# EAGLE design ddc_kvm (EAGLE 6.6.0)
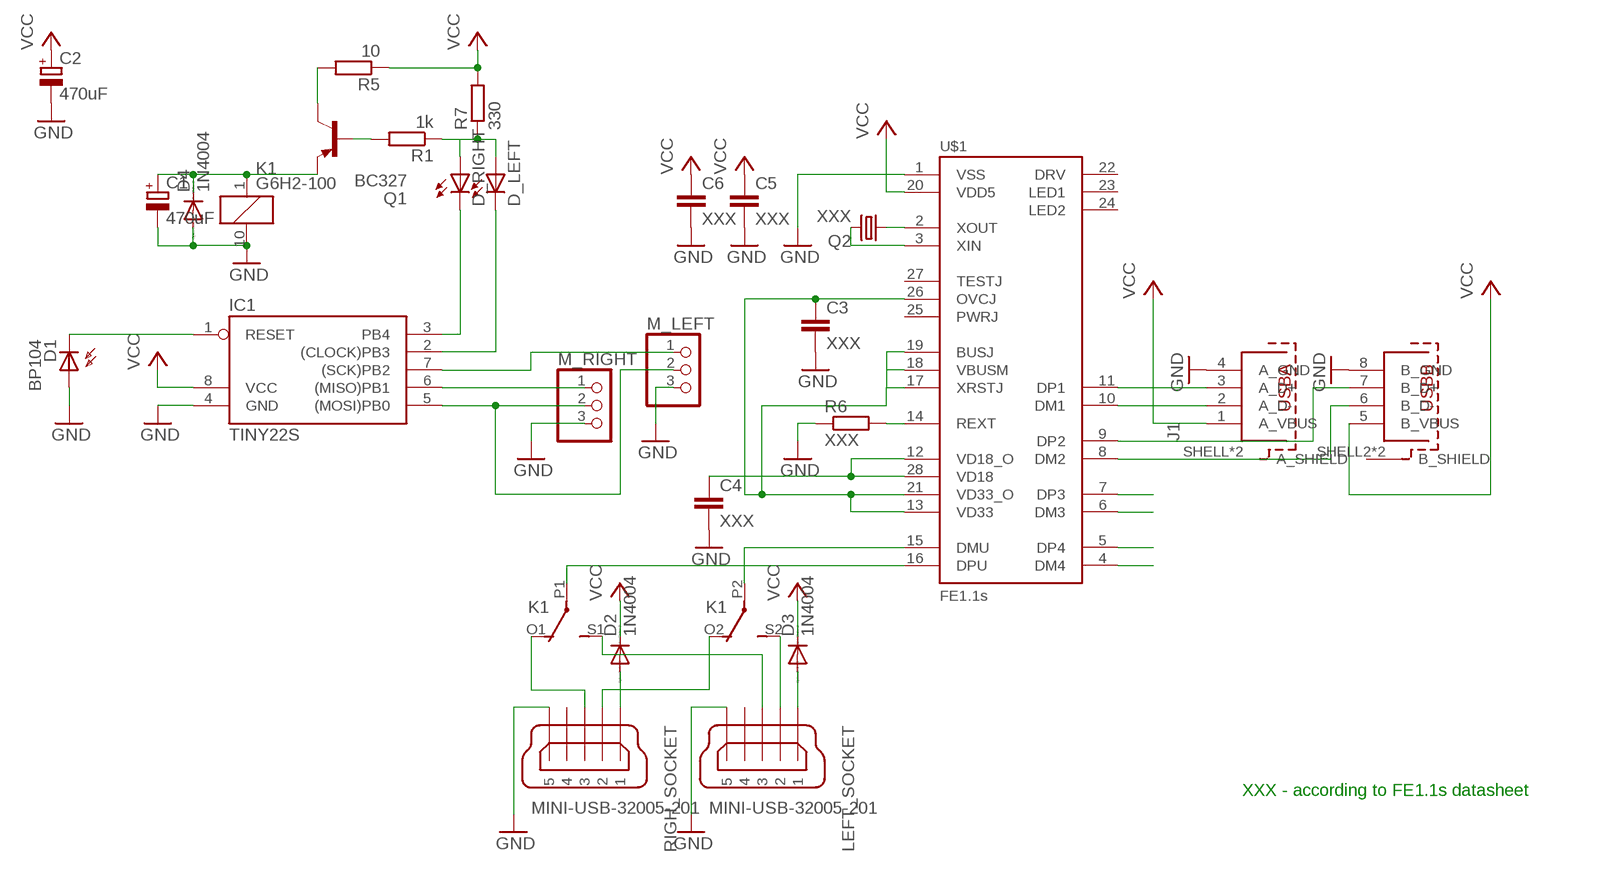
[diagram p0: schematic, sheet 1]

## Parts
C1  470uF  CPOL-EUE3.5-8  [E3,5-8]
C2  470uF  CPOL-EUE3.5-10  [E3,5-10]
C3  XXX  C-EUC0603  [C0603]
C4  XXX  C-EUC0603  [C0603]
C5  XXX  C-EUC0603  [C0603]
C6  XXX  C-EUC0603  [C0603]
D1  BP104  [BP104]
D2  1N4004  [DO41-10]
D3  1N4004  [DO41-10]
D4  1N4004  [DO41-10]
D_LEFT  LED5MM  [LED5MM]
D_RIGHT  LED5MM  [LED5MM]
IC1  TINY22S  [SOIC8]
J1  61400826021  [61400826021]
K1  G6H2-100  [G6H2-100]
LEFT_SOCKET  MINI-USB-32005-201  [32005-201]
M_LEFT  PINHD-1X3  [1X03]
M_RIGHT  PINHD-1X3  [1X03]
Q1  BC327  [TO92]
Q2  XXX  CRYSTALHC49S  [HC49/S]
R1  1k  R-EU_R0603  [R0603]
R5  10  R-EU_0204/2V  [0204V]
R6  XXX  R-EU_R0603  [R0603]
R7  330  R-EU_R0603  [R0603]
RIGH_SOCKET  MINI-USB-32005-201  [32005-201]
U$1  FE1.1S  [FE1.1S_SSOP-28]

## Nets
GND: C1.- C2.- C3.2 C4.2 C5.2 C6.2 D1.A D4.A IC1.4(GND) J1.4(A_GND) J1.8(B_GND) K1.10 LEFT_SOCKET.5 M_LEFT.3 M_RIGHT.3 R6.1 RIGH_SOCKET.5 U$1.1(VSS)
N$1: J1.3(A_D+) U$1.11(DP1)
N$2: J1.2(A_D-) U$1.10(DM1)
N$3: J1.7(B_D+) U$1.9(DP2)
N$4: J1.6(B_D-) U$1.8(DM2)
N$5: Q2.1 U$1.2(XOUT)
N$6: Q2.2 U$1.3(XIN)
N$7: R6.2 U$1.14(REXT)
N$8: K1.S2(3:S) LEFT_SOCKET.2
N$9: K1.O1(2:O) RIGH_SOCKET.3
N$10: K1.P2(3:P) U$1.15(DMU)
N$11: K1.O2(3:O) RIGH_SOCKET.2
N$12: K1.S1(2:S) LEFT_SOCKET.3
N$13: K1.P1(2:P) U$1.16(DPU)
N$14: D3.A LEFT_SOCKET.1
N$15: D2.A RIGH_SOCKET.1
N$16: IC1.5((MOSI)PB0) M_LEFT.2 M_RIGHT.2
N$17: D1.K(C) IC1.1(RESET)
N$18: IC1.6((MISO)PB1) M_RIGHT.1
N$19: IC1.7((SCK)PB2) M_LEFT.1
N$20: Q1.3(C) R5.2
N$21: D_RIGHT.K(C) IC1.3(PB4)
N$22: D_LEFT.K(C) IC1.2((CLOCK)PB3)
N$23: D_LEFT.A D_RIGHT.A R1.1 R7.1
N$24: Q1.2(B) R1.2
N$25: C1.+ D4.C K1.1 Q1.1(E)
N$26: C3.1 U$1.13(VD33) U$1.17(XRSTJ) U$1.18(VBUSM) U$1.19(BUSJ) U$1.21(VD33_O) U$1.26(OVCJ)
N$27: C4.1 U$1.12(VD18_O) U$1.28(VD18)
N$28: U$1.7(DP3)
N$29: U$1.6(DM3)
N$30: U$1.5(DP4)
N$31: U$1.4(DM4)
VCC: C2.+ C5.1 C6.1 D2.C D3.C IC1.8(VCC) J1.1(A_VBUS) J1.5(B_VBUS) R5.1 R7.2 U$1.20(VDD5)
Unconnected: J1.SHELL1(A_SHIELD) J1.SHELL2(B_SHIELD) J1.SHELL3(B_SHIELD) J1.SHELL(A_SHIELD) LEFT_SOCKET.4 RIGH_SOCKET.4 U$1.22(DRV) U$1.23(LED1) U$1.24(LED2) U$1.25(PWRJ) U$1.27(TESTJ)

## Notes on the sheet
- XXX - according to FE1.1s datasheet

## Library data of the parts
C1 C2 = resistor:CPOL-EU: POLARIZED CAPACITOR, European symbol
C3-C6 = resistor:C-EU: CAPACITOR, European symbol
D1 = opto-trans-siemens:BP104: PHOTO DIODE; MF: VISHAY/TELEFUNKEN; MPN: BP104; OC_FARNELL: 1779636; OC_NEWARK: 14M4504
D2-D4 = diode:1N4004: DIODE general purpose rectifier, 1 A
D_LEFT D_RIGHT = led:LED: LED OSRAM: - CHIPLED LG R971, LG N971, LY N971, LG Q971, LY Q971, LO R971, LY R971 LH N974, LH R974 LS Q976, LO Q976, LY Q976 LO Q996 - Hyper CHIPLED LW Q18S LB Q993, LB Q99A, LB R99A - SideLED LS A670, LO A670, LY A670, LG A670, LP A670 LB A673, LV A673, LT A673, LW A673 LH A674 LY A675 LS A676, LA A676, LO A676, LY A676, LW A676 LS A679, LY A679, LG A679 - Hyper Micro SIDELED® LS Y876, LA Y876, LO Y876, LY Y876 LT Y87S - SmartLED LW L88C, LW L88S LB L89C, LB L89S, LG L890 LS L89K, LO L89K, LY L89K LS L896, LA L896, LO L896, LY L896 - TOPLED LS T670, LO T670, LY T670, LG T670, LP T670 LSG T670, LSP T670, LSY T670, LOP T670, LYG T670 LG T671, LOG T671, LSG T671 LB T673, LV T673, LT T673, LW T673 LH T674 LS T676, LA T676, LO T676, LY T676, LB T676, LH T676, LSB T676, LW T676 LB T67C, LV T67C, LT T67C, LS T67K, LO T67K, LY T67K, LW E67C LS E67B, LA E67B, LO E67B, LY E67B, LB E67C, LV E67C, LT E67C LW T67C LS T679, LY T679, LG T679 LS T770, LO T770, LY T770, LG T770, LP T770 LB T773, LV T773, LT T773, LW T773 LH T774 LS E675, LA E675, LY E675, LS T675 LS T776, LA T776, LO T776, LY T776, LB T776 LHGB T686 LT T68C, LB T68C - Hyper Mini TOPLED® LB M676 - Mini TOPLED Santana® LG M470 LS M47K, LO M47K, LY M47K Source: http://www.osram.convergy.de LUXEON: - LUMILED® LXK2-PW12-R00, LXK2-PW12-S00, LXK2-PW14-U00, LXK2-PW14-V00 LXK2-PM12-R00, LXK2-PM12-S00, LXK2-PM14-U00 LXK2-PE12-Q00, LXK2-PE12-R00, LXK2-PE12-S00, LXK2-PE14-T00, LXK2-PE14-U00 LXK2-PB12-K00, LXK2-PB12-L00, LXK2-PB12-M00, LXK2-PB14-N00, LXK2-PB14-P00, LXK2-PB14-Q00 LXK2-PR12-L00, LXK2-PR12-M00, LXK2-PR14-Q00, LXK2-PR14-R00 LXK2-PD12-Q00, LXK2-PD12-R00, LXK2-PD12-S00 LXK2-PH12-R00, LXK2-PH12-S00 LXK2-PL12-P00, LXK2-PL12-Q00, LXK2-PL12-R00 Source: www.luxeon.com KINGBRIGHT: KA-3528ASYC Source: www.kingbright.com
IC1 = atmel:TINY22: MICROCONTROLLER 1K ROM 128 bytes RAM 128 bytes EEPROM; OC_FARNELL: unknown; OC_NEWARK: unknown
J1 = InputOutputIO (rev18a):61400826021: WR-COM Horizontal Dual Stacked USB Type A=>Code : Con_I-O_COM_USB-2.0_A_61400826021 <http://katalog.we-online.de/media/images/eican/Con_I-O_COM_USB-2.0_A_61400826021_pf2.jpg> Details see: http://katalog.we-online.de/en/em/614_008_260_21 Created 2014-07-09, Karrer Zheng 2014 (C) Würth Elektronik
K1 = relay:G6H2-100: RELAY 2 x switch, 0.5 A/125 V AC, 1 A/30 V DC, Omron; OC_FARNELL: unknown; OC_NEWARK: unknown
LEFT_SOCKET RIGH_SOCKET = con-cypressindustries:MINI-USB-: MINI USB-B Conector Source: www.cypressindustries.com; OC_FARNELL: unknown; OC_NEWARK: unknown
M_LEFT M_RIGHT = pinhead:PINHD-1X3: PIN HEADER
Q1 = transistor-pnp:BC327: PNP Transistor
Q2 = crystal:CRYSTAL: CRYSTAL; OC_FARNELL: 1667008; OC_NEWARK: unknown
R1 R5-R7 = resistor:R-EU_: RESISTOR, European symbol
U$1 = Ai_IC:FE1.1S

## Board
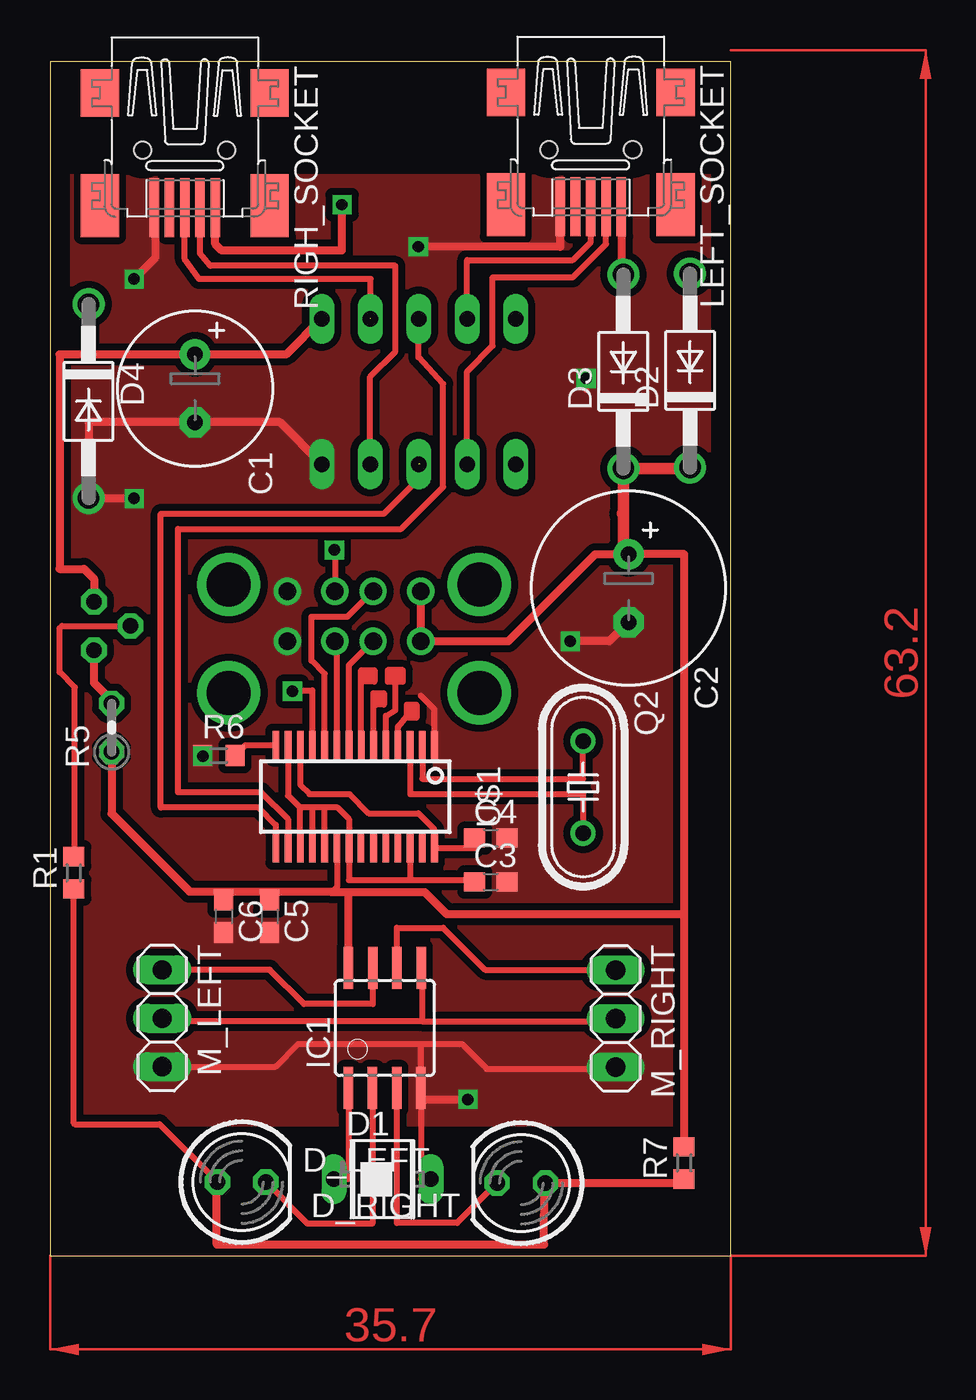
[diagram p1: board, top side]
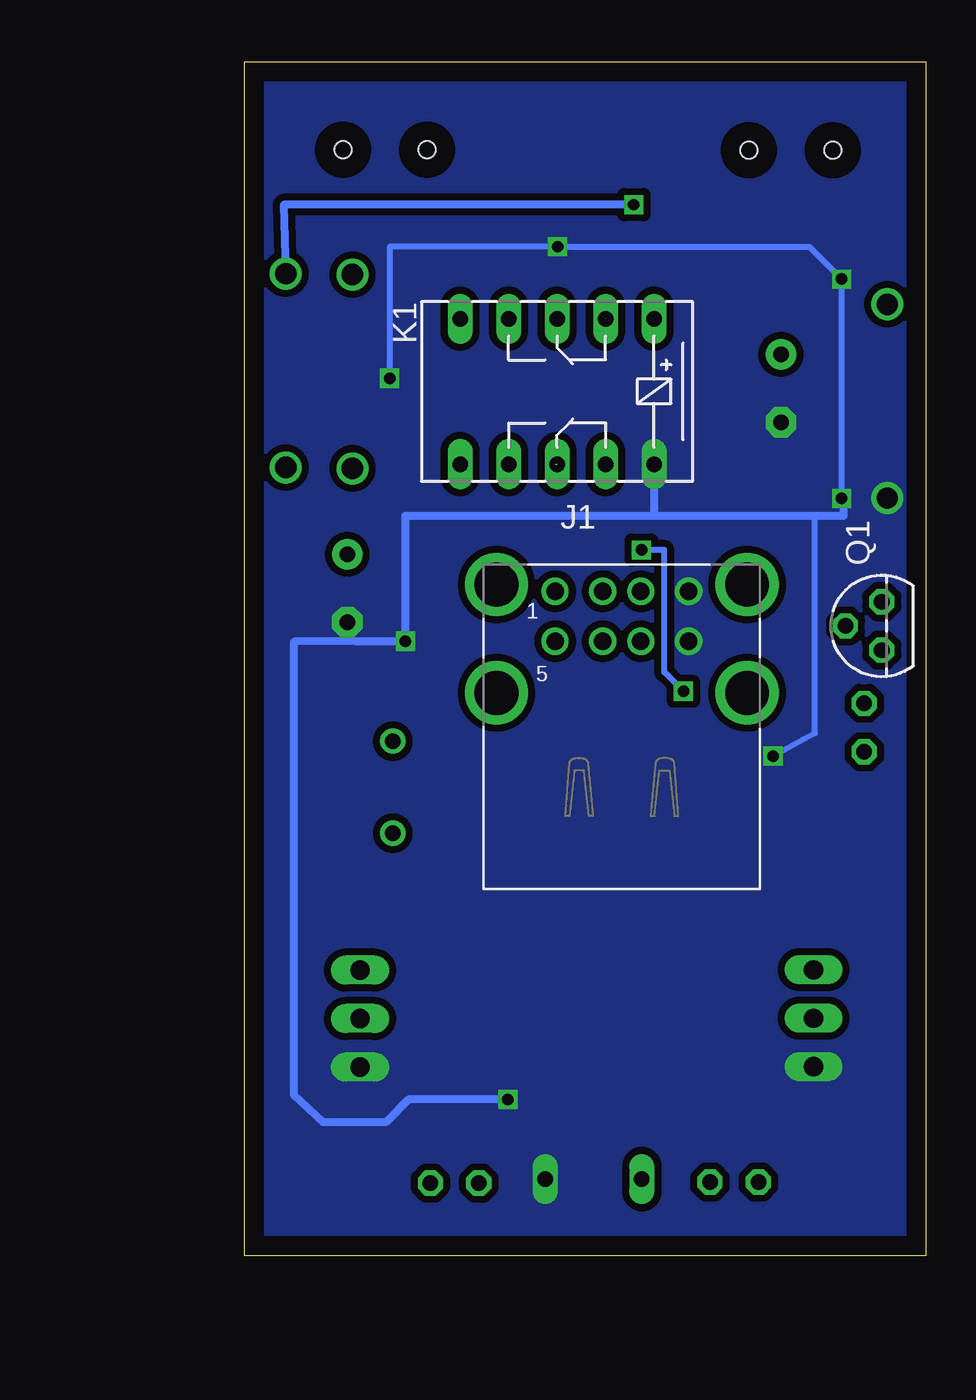
[diagram p2: board, bottom side, seen from below]

Size 35.7 x 62.6 mm. Coordinates in mm from the lower left corner, seen from the top.
Outline: 0,0 35.7,0 35.7,62.6 0,62.6 0,0
Copper layers (1*16): Top 0.035mm / dielectric 1.5mm / Bottom 0.035mm
Design rules "default": minimum track width 10mil, minimum drill 24mil, track to track 8mil, track to pad 8mil, pad to pad 8mil, via to via 8mil, smd to smd 8mil, copper to edge 40mil, drill to drill 8mil, minimum pad ring 10mil, minimum via ring 8mil, stop-mask expansion 4mil, vias tented up to drill 0mil, thermal gap 10mil

### Footprints (pad centres in the part's own frame; a part is rotated, then mirrored left to right if it is on the bottom)
E3,5-8 = drill 0.813 pad 1.6: + -1.778,0 | drill 0.813 pad 1.6 octagon: - 1.778,0
E3,5-10 = drill 0.813 pad 1.6: + -1.778,0 | drill 0.813 pad 1.6 octagon: - 1.778,0
C0603 = smd 1.1 x 1: 1 -0.85,0; 2 0.85,0
BP104 = drill 0.813 long: A 0,2.54; K 0,-2.54
DO41-10 = drill 1.118: A 5.08,0; C -5.08,0
LED5MM = drill 0.813 octagon: A -1.27,0; K 1.27,0
SOIC8 = smd 0.5 x 2.2: 1 -1.905,-3.154; 2 -0.645,-3.154; 3 0.625,-3.154; 4 1.895,-3.154; 5 1.905,3.154; 6 0.635,3.154; 7 -0.635,3.154; 8 -1.905,3.154
61400826021 = drill 0.92: 1 -3.5,5.33; 2 -1,5.33; 3 1,5.33; 4 3.5,5.33; 5 -3.5,2.71; 6 -1,2.71; 7 1,2.71; 8 3.5,2.71 | drill 2.3: SHELL -6.57,5.68; SHELL1 6.57,5.68; SHELL2 6.57,0; SHELL3 -6.57,0
G6H2-100 = drill 0.813 long: 1 -5.08,-3.81; 5 5.08,-3.81; 6 5.08,3.81; 10 -5.08,3.81; O1 -2.54,-3.81; O2 -2.54,3.81; P1 0,-3.81; P2 0,3.81; S1 2.54,-3.81; S2 2.54,3.81
32005-201 = smd 3.1 x 0.5: 1 3,1.6; 2 3,0.8; 3 3,0; 4 3,-0.8; 5 3,-1.6 | smd 2.5 x 2: M1 -3,-4.45; M2 -3,4.45 | smd 3.3 x 2: M3 2.9,4.45; M4 2.9,-4.45 | hole 0.9: 0,2.2; 0,-2.2
1X03 = drill 1.016 long: 1 -2.54,0; 2 0,0; 3 2.54,0
TO92 = drill 0.813 octagon: 1 1.27,0; 2 0,1.905; 3 -1.27,0
HC49/S = drill 0.813: 1 -2.413,0; 2 2.413,0
R0603 = smd 1 x 1.1: 1 -0.85,0; 2 0.85,0
0204V = drill 0.813 octagon: 1 -1.27,0; 2 1.27,0
FE1.1S_SSOP-28 = smd 0.35 x 1.5: 1 -4.16,-2.7; 2 -3.52,-2.7; 3 -2.88,-2.7; 4 -2.24,-2.7; 5 -1.6,-2.7; 6 -0.96,-2.7; 7 -0.32,-2.7; 8 0.32,-2.7; 9 0.96,-2.7; 10 1.6,-2.7; 11 2.24,-2.7; 12 2.88,-2.7; 13 3.52,-2.7; 14 4.16,-2.7; 15 4.16,2.7; 16 3.52,2.7; 17 2.88,2.7; 18 2.24,2.7; 19 1.6,2.7; 20 0.96,2.7; 21 0.32,2.7; 22 -0.3,2.7; 23 -0.96,2.7; 24 -1.6,2.7; 25 -2.24,2.7; 26 -2.88,2.7; 27 -3.52,2.7; 28 -4.16,2.7

### Placement (x,y rotation side)
C1  7.59,45.47 270 top
C2  30.32,35 270 top
C3  23.1,19.6 0 top
C4  23.1,21.9 0 top
C5  11.5,17.8 270 top
C6  9.1,17.8 270 top
D1  17.42,4.02 270 top
D2  33.55,46.41 90 top
D3  30.05,46.36 90 top
D4  2.01,44.8 270 top
D_LEFT  10.04,3.87 0 top
D_RIGHT  24.7,3.82 180 top
IC1  17.54,11.95 0 top
J1  15.93,29.51 0 bottom
K1  19.32,45.31 180 bottom
LEFT_SOCKET  28.34,57.99 270 top
M_LEFT  5.87,12.45 270 top
M_RIGHT  29.65,12.44 270 top
Q1  2.3,33.02 90 bottom
Q2  27.94,24.57 270 top
R1  1.25,20.07 90 top
R5  3.22,27.69 90 top
R6  8.84,26.22 0 top
R7  33.24,4.87 90 top
RIGH_SOCKET  7.06,57.95 270 top
U$1  15.99,24.07 180 top

### Tracks (layer width: path | path; a pad name or v marks a point on that pad's centre or on a via)
GND  (via drill 0.6)
  Top 0.305: 5.5,54.95 RIGH_SOCKET.5 | M_LEFT.3 11.81,9.91 13,11.1 19.4,11.1 | 19.4,11.1 21.6,11.1 22.9,9.8 30.45,9.8 M_RIGHT.3 | 19.4,11.1 19.43,11.06 IC1.4 19.43,7.86 19.43,4.02 D1.A | U$1.1 20.15,28.65 19.43,29.37 | R6.1 7.9,26.13 v8,26.2 | v28.1,46 28.1,45.4
  Top 0.406: K1.10 12.05,43.69 C1.- 2.01,43.69 D4.A 2.01,39.7 v4.4,39.7 | C2.- 29.32,32.22 v27.27,32.22 | 19.43,7.86 arc-90 19.78,8.2 v21.9,8.2 | RIGH_SOCKET.5 5.4,54.95 | 5.5,54.95 5.5,52.3 v4.4,51.2 | LEFT_SOCKET.5 26.74,52.9 v19.3,52.9
  Bottom 0.305: v8,26.2 5.8,27.4 5.8,38.8 | v4.4,39.7 v4.4,51.2 6.1,52.9 v19.3,52.9 28.1,52.9 v28.1,46
  Bottom 0.406: v4.4,39.7 4.3,39.7 4.3,38.8 5.8,38.8 27.27,38.8 v27.27,32.22 29.88,32.22 33.1,32.2 33.1,8.4 31.6,7 28.3,7 27.1,8.2 v21.9,8.2 | K1.10 14.24,38.9 14.2,38.9
  pour Bottom (isolate 0.37, no thermals): -0.8,62.9 36.4,62.9 36.4,-1.1 -0.8,-1.1
  pour Top (isolate 0.37, no thermals): -1.1,56.6 37.2,56.6 37.1,6.9 -1.2,6.9
N$1  (via drill 0.6)
  Top 0.305: U$1.11 13.75,29.54 | 13.75,29.54 13.75,29.65 | 13.75,29.54 13.69,29.6 v12.7,29.6 | v14.9,37 14.93,37.2 J1.3
  Bottom 0.305: v12.7,29.6 13.7,30.6 13.7,37 v14.9,37
N$2
  Top 0.305: U$1.10 14.39,30.51 13.7,31.2 13.7,33.5 15.59,33.5 J1.2
N$3
  Top 0.305: U$1.9 15.03,32.12 J1.7
N$4
  Top 0.305: U$1.8 15.67,30.96 J1.6
N$5
  Top 0.305: U$1.2 19.51,25 27.94,25 Q2.1
N$6
  Top 0.305: U$1.3 18.87,24.2 27.94,24.2 Q2.2
N$7
  Top 0.305: R6.2 10.24,26.77 U$1.14
N$8
  Top 0.305: K1.S2 21.86,46.36 23.2,47.7 23.2,51.3 27.4,51.3 29.14,53.04 LEFT_SOCKET.2
N$9  (1 unrouted)
  Top 0.305: RIGH_SOCKET.3 7.06,52.24 7.8,51.2 16.8,51.2 16.8,49.14
N$10  (1 unrouted)
  Top 0.305: 19.4,41.5 19.4,40.8 17.5,38.9 5.8,38.9 5.8,23.5 10.93,23.5 11.83,22.6 U$1.15
N$11
  Top 0.305: K1.O2 16.78,46.08 18.1,47.4 18.1,51.9 8.4,51.9 7.86,52.54 RIGH_SOCKET.2
N$12
  Top 0.305: K1.S1 21.86,52.2 27.4,52.2 28.34,53.14 LEFT_SOCKET.3 28.3,54.95
N$13
  Top 0.305: K1.P1 19.3,49.1 19.3,47.1 20.6,45.7 20.6,40.3 18.4,38.1 6.7,38.1 6.7,24.3 11.07,24.3 12.47,22.9 U$1.16
N$14
  Top 0.406: LEFT_SOCKET.1 29.94,51.44 D3.A
N$15  (via drill 0.6)
  Top 0.406: v15.3,55.1 15.3,52.7 9,52.7 8.66,53.04 RIGH_SOCKET.1
  Bottom 0.406: v15.3,55.1 33.65,55.1 D2.A
N$16
  Top 0.305: 30.55,12.45 M_RIGHT.2 arc-90 30.41,12.3 19.5,12.3 | IC1.5 19.5,15.05 19.5,12.3 | 19.5,12.3 5.02,12.3 arc-90 M_LEFT.2
N$17
  Top 0.305: IC1.1 15.63,4.02 D1.K
N$18
  Top 0.305: IC1.6 18.18,17.2 20.6,17.2 22.8,15 30.54,15 M_RIGHT.1
N$19
  Top 0.305: IC1.7 16.91,13.2 13.3,13.2 11.51,14.99 M_LEFT.1
N$20
  Top 0.406: R5.2 3.3,29.04 2.3,30.04 Q1.3
N$21
  Top 0.305: IC1.3 18.16,1.72 21.33,1.72 D_RIGHT.K
N$22
  Top 0.305: IC1.2 16.89,1.69 13.48,1.69 D_LEFT.K
N$23
  Top 0.305: R1.1 1.25,6.96 1.3,6.9 5.74,6.9 D_LEFT.A
  Top 0.406: D_LEFT.A 8.74,3.87 8.74,0.6 25.9,0.6 25.92,3.82 D_RIGHT.A 33.04,3.82 R7.1
N$24
  Top 0.305: R1.2 1.3,20.98 1.3,29.8 0.5,30.6 0.5,32.9 0.62,33.02 Q1.2
N$25
  Top 0.406: K1.1 12.37,47.25 C1.+ 2.01,47.25 | 2.01,47.25 D4.C | 2.01,47.25 0.5,47.25 0.5,36.01 1.78,36.01 2.3,35.49 Q1.1
N$26
  Top 0.305: 18.9,19.7 15.67,19.7 U$1.21 15.67,22.9 15.07,23.5 14.39,23.5 | 18.9,19.7 18.9,21.37 U$1.26 | 18.9,19.7 22.15,19.7 arc-90 C3.1 | 13.75,23.5 14.3,23.5 14.39,23.5 | 13.75,23.5 13.1,23.5 | U$1.13 12.47,24.13 13.1,23.5 | U$1.17 13.1,23.5 | U$1.18 13.75,23.5 | U$1.19 14.39,23.5
N$27
  Top 0.305: C4.1 22.25,21.37 U$1.28 20.15,22.35 19.3,23.2 16.7,23.2 15.7,24.2 13.6,24.2 13.11,24.69 U$1.12
N$28
  Top 0.305: U$1.7 16.31,30.4 16.3,30.4 16.3,30.7 17,30.7 17,30.1 16.4,30.1 16.4,30.4 16.5,30.4 16.5,30.5 16.8,30.5 16.8,30.3 16.6,30.3
N$29
  Top 0.305: U$1.6 16.95,29.5 17.5,29.5 17.5,28.9 17.1,28.9 17.1,29.3 17.2,29.3 17.2,29.1 17.3,29.1 17.3,29
N$30
  Top 0.305: U$1.5 17.59,27.2 17.6,27.2 17.6,28.3 18.1,28.6 18.1,30.7 | 18.1,30.7 17.8,30.7 | 17.8,30.7 17.7,30.7 17.7,30.1 18.5,30.1 18.5,30.7 18.1,30.7 | 17.8,30.7 17.8,30.5 18.3,30.5 18.3,30.4 17.9,30.4 17.9,30.3
N$31
  Top 0.305: U$1.4 18.23,27.73 18.7,28.3 | 18.7,28.3 18.7,28.9 19.2,28.9 19.2,28.2 18.8,28.2 18.7,28.3 | 18.7,28.3 18.9,28.4 19,28.4 18.9,28.8
VCC
  Top 0.305: U$1.20 15.03,19.33 14.75,19.05 | C5.1 11.5,19.1 11.6,19.1 | C6.1 9.1,19.1
  Top 0.406: C2.+ 30.05,36.78 | 15.63,19.05 19.65,19.05 20.8,17.9 33.25,17.9 | 15.63,19.05 15,19.05 | 15,19.05 14.75,19.05 | R5.1 3.22,23.18 7.3,19.1 9.1,19.1 11.6,19.1 14.95,19.1 15,19.05 | R7.2 33.25,5.74 33.25,17.9 | 33.25,17.9 33.25,36.78 C2.+ | IC1.8 15.63,19.05 | J1.1 J1.5 24.02,32.22 28.58,36.78 C2.+
  Top 0.61: 30,38.9 30.05,38.95 | 30.05,38.95 D3.C 33.5,41.28 D2.C | 30.05,36.78 30.05,38.95
(copper drawn outside any net)
  shapes: Top area x2